# Altium schematic sheet main.SchDoc
size A
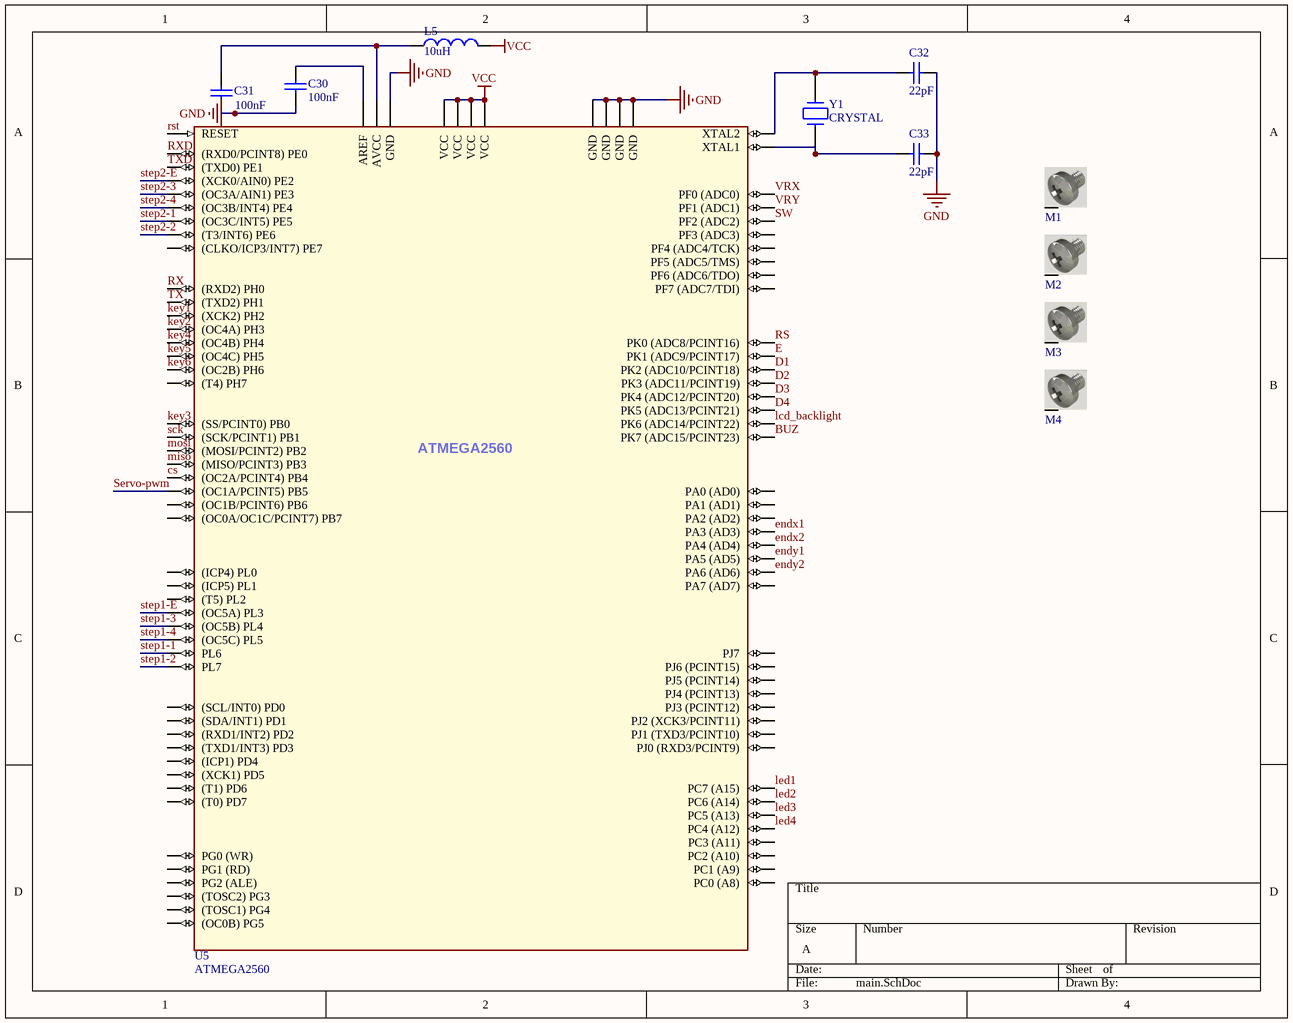
[diagram p0: main.SchDoc]

## Parts
C30  value 100nF  [CAP 1206/3216 - 0.8MM]  (hidden comment: Cap)
C31  value 100nF  [CAP 1206/3216 - 0.8MM]  (hidden comment: Cap)
C32  value 22pF  [CAP 1206/3216 - 0.8MM]  (hidden comment: Cap)
C33  value 22pF  [CAP 1206/3216 - 0.8MM]  (hidden comment: Cap)
L5  value 10uH  [C1210_M]  (hidden comment: Inductor)
M1  Screw  [Board Screw]  (value not drawn)
M2  Screw  [Board Screw]  (value not drawn)
M3  Screw  [Board Screw]  (value not drawn)
M4  Screw  [Board Screw]  (value not drawn)
U5  ATMEGA2560  [MY_ATMEGA2560]
Y1  CRYSTAL  [My_Crystal]

## Nets
GND: C30.1 C31.1 C32.2 C33.2 U5.11(GND) U5.32(GND) U5.62(GND) U5.81(GND) U5.99(GND)
VCC: L5.2 U5.10(VCC) U5.31(VCC) U5.61(VCC) U5.80(VCC)
BUZ: U5.82(PK7_(ADC15/PCINT23))
cs: U5.23((OC2A/PCINT4)_PB4)
D1: U5.87(PK2_(ADC10/PCINT18))
D2: U5.86(PK3_(ADC11/PCINT19))
D3: U5.85(PK4_(ADC12/PCINT20))
D4: U5.84(PK5_(ADC13/PCINT21))
E: U5.88(PK1_(ADC9/PCINT17))
endx1: U5.75(PA3_(AD3))
endx2: U5.74(PA4_(AD4))
endy1: U5.73(PA5_(AD5))
endy2: U5.72(PA6_(AD6))
key1: U5.14((XCK2)_PH2)
key2: U5.15((OC4A)_PH3)
key3: U5.19((SS/PCINT0)_PB0)
key4: U5.16((OC4B)_PH4)
key5: U5.17((OC4C)_PH5)
key6: U5.18((OC2B)_PH6)
lcd_backlight: U5.83(PK6_(ADC14/PCINT22))
led1: U5.60(PC7_(A15))
led2: U5.59(PC6_(A14))
led3: U5.58(PC5_(A13))
led4: U5.57(PC4_(A12))
miso: U5.22((MISO/PCINT3)_PB3)
mosi: U5.21((MOSI/PCINT2)_PB2)
RS: U5.89(PK0_(ADC8/PCINT16))
rst: U5.30(RESET)
RX: U5.12((RXD2)_PH0)
RXD: U5.2((RXD0/PCINT8)_PE0)
sck: U5.20((SCK/PCINT1)_PB1)
Servo-pwm: U5.24((OC1A/PCINT5)_PB5)
step1-1: U5.41(PL6)
step1-2: U5.42(PL7)
step1-3: U5.39((OC5B)_PL4)
step1-4: U5.40((OC5C)_PL5)
step1-E: U5.38((OC5A)_PL3)
step2-1: U5.7((OC3C/INT5)_PE5)
step2-2: U5.8((T3/INT6)_PE6)
step2-3: U5.5((OC3A/AIN1)_PE3)
step2-4: U5.6((OC3B/INT4)_PE4)
step2-E: U5.4((XCK0/AIN0)_PE2)
SW: U5.95(PF2_(ADC2))
TX: U5.13((TXD2)_PH1)
TXD: U5.3((TXD0)_PE1)
VRX: U5.97(PF0_(ADC0))
VRY: U5.96(PF1_(ADC1))
NetC30_2: C30.2 U5.98(AREF)
NetC31_2: C31.2 L5.1 U5.100(AVCC)
NetC32_1: C32.1 U5.33(XTAL2) Y1.1
NetC33_1: C33.1 U5.34(XTAL1) Y1.2

Not connected (* = marked no-connect by the designer): M1 S; M2 S; M3 S; M4 S; U5 1((OC0B)_PG5) 9((CLKO/ICP3/INT7)_PE7) 25((OC1B/PCINT6)_PB6) 26((OC0A/OC1C/PCINT7)_PB7) 27((T4)_PH7) 28((TOSC2)_PG3) 29((TOSC1)_PG4) 35((ICP4)_PL0) 36((ICP5)_PL1) 37((T5)_PL2) 43((SCL/INT0)_PD0) 44((SDA/INT1)_PD1) 45((RXD1/INT2)_PD2) 46((TXD1/INT3)_PD3) 47((ICP1)_PD4) 48((XCK1)_PD5) 49((T1)_PD6) 50((T0)_PD7) 51(PG0_(WR)) 52(PG1_(RD)) 53(PC0_(A8)) 54(PC1_(A9)) 55(PC2_(A10)) 56(PC3_(A11)) 63(PJ0_(RXD3/PCINT9)) 64(PJ1_(TXD3/PCINT10)) 65(PJ2_(XCK3/PCINT11)) 66(PJ3_(PCINT12)) 67(PJ4_(PCINT13)) 68(PJ5_(PCINT14)) 69(PJ6_(PCINT15)) 70(PG2_(ALE)) 71(PA7_(AD7)) 76(PA2_(AD2)) 77(PA1_(AD1)) 78(PA0_(AD0)) 79(PJ7) 90(PF7_(ADC7/TDI)) 91(PF6_(ADC6/TDO)) 92(PF5_(ADC5/TMS)) 93(PF4_(ADC4/TCK)) 94(PF3_(ADC3))

## Library data of the parts
C30-C33 = Cap ceramic: CAP-100Nf
L5 = Inductor: Code_IEC: 1005; Published: 8-Jun-2000; LatestRevisionDate: 29-May-2009; LatestRevisionNote: IPC-7351 Footprint Added.; PackageReference: 0402-A; Publisher: Altium Limited; PackageDescription: Chip Inductor; Code_JEITA: 0402
M1-M4 = Board Screw: Board Screw With Spacer
U5 = ATMEGA2560: AVR 256K Bytes of In-System Programmable Flash Memory